# EAGLE design Blinky_Jaras (EAGLE 8.2.0)
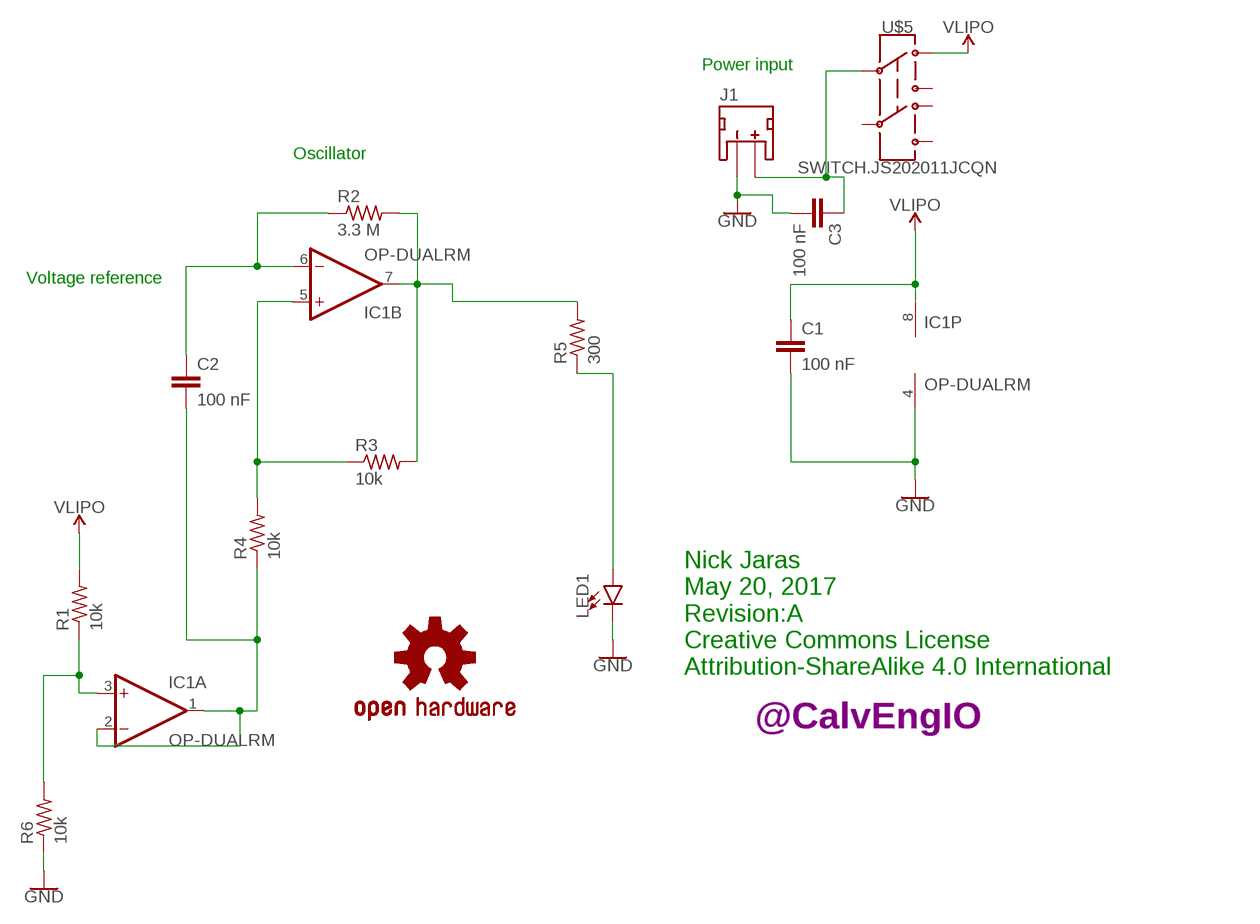
[diagram p0: schematic, sheet 1]

## Parts
C1  100 nF  CAPACITOR0402  [C0402]
C2  100 nF  CAPACITOR0402  [C0402]
C3  100 nF  CAPACITOR0402  [C0402]
IC1  OP-DUALRM  [MSOP08]
J1  JST_2MM_MALE  [JST-2-SMD]
LED1  LED0603  [LED-0603]
LOGO1  OSHW-LOGOS  [OSHW-LOGO-S]
R1  10k  RESISTOR0402  [R0402]
R2  3.3 M  RESISTOR0402  [R0402]
R3  10k  RESISTOR0402  [R0402]
R4  10k  RESISTOR0402  [R0402]
R5  300  RESISTOR0402  [R0402]
R6  10k  RESISTOR0402  [R0402]
U$4  CALVENGIO_HANDLEHANDLE.05  [CALVENGIO_HANDLE.05]
U$5  SWITCH.JS202011JCQN  [SWITCH.00]

## Nets
GND: C1.2 C3.2 IC1.4(P:V-) J1.1(-) LED1.C R6.1
N$1: C3.1 J1.2(+) U$5.2
N$2: IC1.5(B:+IN) R3.1 R4.2
N$3: IC1.7(B:OUT) R2.2 R3.2 R5.2
N$4: C2.1 IC1.6(B:-IN) R2.1
N$7: LED1.A R5.1
N$8: C2.2 IC1.1(A:OUT) IC1.2(A:-IN) R4.1
N$10: IC1.3(A:+IN) R1.1 R6.2
VLIPO: C1.1 IC1.8(P:V+) R1.2 U$5.1
Unconnected: J1.NC1(PAD1) J1.NC2(PAD2) U$5.3 U$5.5 U$5.6 U$5.7

## Notes on the sheet
- Power input
- Oscillator
- Voltage reference
- Nick Jaras
  May 20, 2017
  Revision:A
  Creative Commons License
  Attribution-ShareAlike 4.0 International

## Library data of the parts
C1-C3 = CalvEngIO-Passives:CAPACITOR
IC1 = CalvEngIO-AnalogIC:OP-DUAL: Precision Micropower, Low Noise CMOS, Rail-to-Rail Input/Output Operational Amplifiers Source: http://www.analog.com/static/imported-files/data_sheets/AD8603_8607_8609.pdf; MF: ALTERA CORPORATION; MPN: AD8607ARMZ-REEL; OC_FARNELL: 1464990; OC_NEWARK: 59K6925
J1 = CalvEngIO-Connectors:JST_2MM_MALE: JST 2MM MALE RA CONNECTOR Two pin, compact surface mount connector. Commonly used as a battery input connection point. We really like the solid locking feeling and high current rating on these small connectors. We use these all the time as battery connectors. Mates to single-cell LiPo batteries. Here is the connector we sell at SparkFun: JST Right Angle Connector - White <https://www.sparkfun.com/products/8612> (PRT-08612) Datasheet <http://www.sparkfun.com/datasheets/Prototyping/Connectors/JST-Horizontal.pdf> It was used on these SparkFun products: SparkFun MOSFET Power Controller <https://www.sparkfun.com/products/11214> (PRT-11214) SparkFun Battery Babysitter - LiPo Battery Manager <https://www.sparkfun.com/products/13777> (PRT-13777) And many, many others that required a lipo battery connection.; PROD_ID: CONN-11443; SF_ID: PRT-08612
LED1 = CalvEngIO-LED:LED: LED (Generic) Standard schematic elements and footprints for 5mm, 3mm, 1206, and 0603 sized LEDs. Generic LEDs with no color specified.
LOGO1 = CalvEngIO-Logos:OSHW-LOGO: Open-Source Hardware (OSHW) Logo This logo indicates the piece of hardware it is found on incorporates a OSHW license and/or adheres to the definition of open source hardware found here: http://freedomdefined.org/OSHW
R1-R6 = CalvEngIO-Passives:RESISTOR
U$4 = CalvEngIO-Logos:CALVENGIO_HANDLE
U$5 = CalvEngIO-Switches:SWITCH.JS202011JCQN

## Board
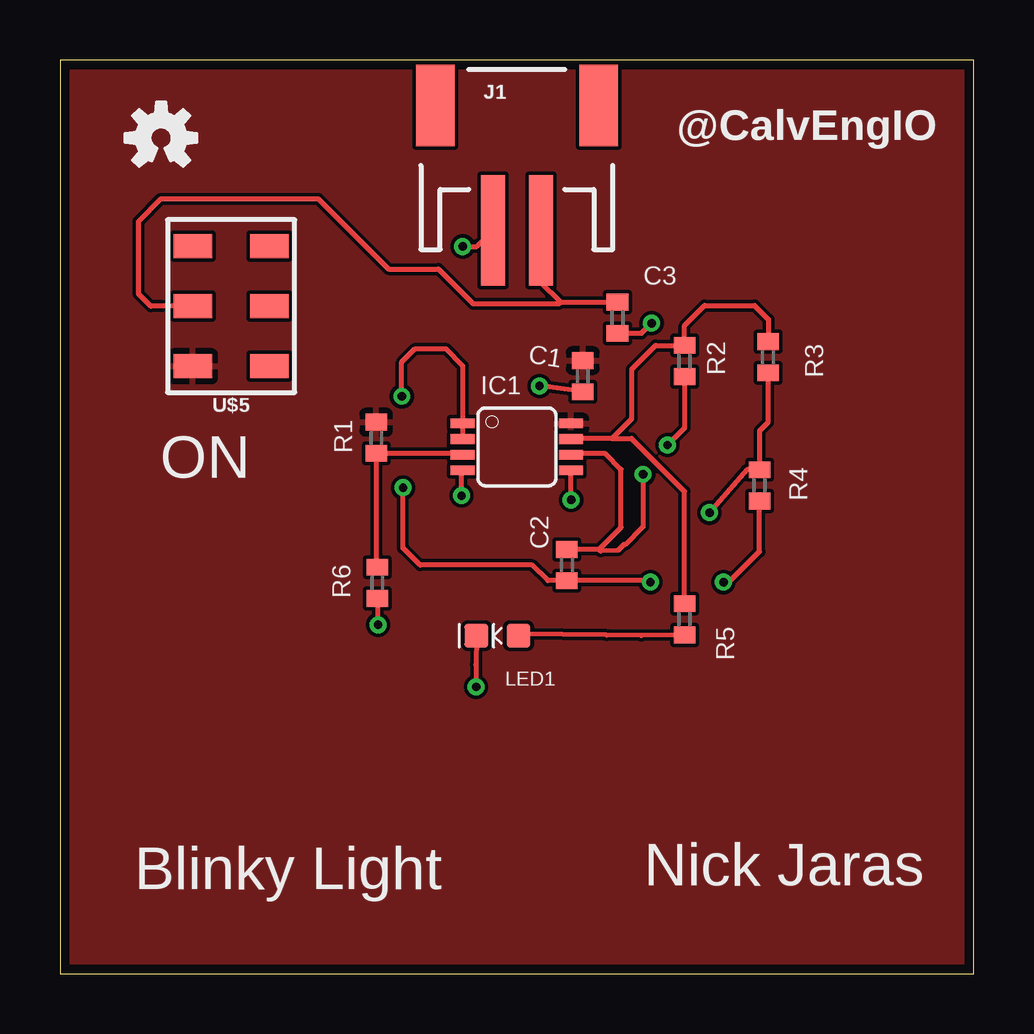
[diagram p1: board, top side]
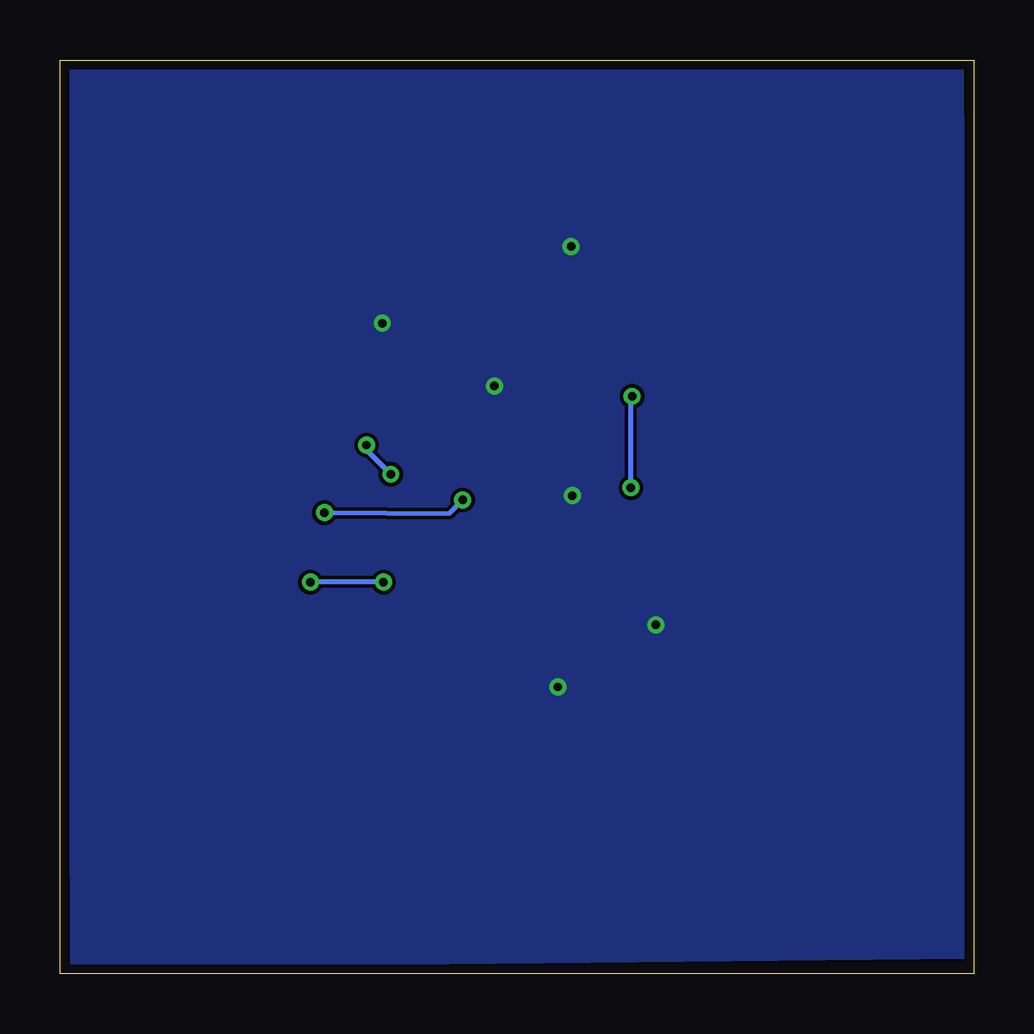
[diagram p2: board, bottom side, seen from below]

Size 38.1 x 38.1 mm. Coordinates in mm from the lower left corner, seen from the top.
Outline: 0,0 38.1,0 38.1,38.1 0,38.1 0,0
Copper layers (1*16): Top 0.0356mm / dielectric 1.5011mm / Bottom 0.0356mm
Design rules "LaenPCBOrder": minimum track width 6mil, minimum drill 13mil, track to track 6mil, track to pad 6mil, pad to pad 6mil, via to via 6mil, smd to smd 6mil, copper to edge 15mil, drill to drill 6mil, minimum pad ring 7mil, minimum via ring 7mil, stop-mask expansion 3mil, vias tented up to drill 0mil, thermal gap 10mil

### Footprints (pad centres in the part's own frame; a part is rotated, then mirrored left to right if it is on the bottom)
C0402 = smd 0.7 x 0.9: 1 -0.65,0; 2 0.65,0
MSOP08 = smd 0.4 x 1: 1 -0.976,-2.263; 2 -0.326,-2.263; 3 0.324,-2.263; 4 0.974,-2.263; 5 0.974,2.262; 6 0.324,2.262; 7 -0.326,2.262; 8 -0.976,2.262
JST-2-SMD = smd 1 x 4.6: 1 -1,-3.7; 2 1,-3.7 | smd 1.6 x 3.4: NC1 -3.4,1.5; NC2 3.4,1.5
LED-0603 = smd 1 x 1: A -0.877,0; C 0.877,0
R0402 = smd 0.7 x 0.9: 1 -0.65,0; 2 0.65,0
SWITCH.00 = smd 1 x 1.6: 1 -2.5,1.6; 2 0,1.6; 3 2.5,1.6; 5 -2.5,-1.6; 6 0,-1.6; 7 2.5,-1.6

### Placement (x,y rotation side)
C1  21.79,24.92 270 top
C2  21.13,17.04 270 top
C3  23.24,27.36 270 top
IC1  19.05,21.97 270 top
J1  19.05,34.7 0 top
LED1  18.24,14.1 180 top
LOGO1  4.22,34.85 0 top
R1  13.18,22.35 90 top
R2  26.04,25.55 90 top
R3  29.51,25.7 90 top
R4  29.16,20.37 90 top
R5  26.04,14.78 90 top
R6  13.23,16.31 90 top
U$4  30.78,34.75 0 top
U$5  7.14,27.84 90 top

### Tracks (layer width: path | path; a pad name or v marks a point on that pad's centre or on a via)
GND  (via drill 0.35 pad 0.6)
  Top 0.203: v13.26,14.55 13.26,15.63 R6.1 | LED1.C 17.34,12.89 v17.35,11.96 | v16.74,19.94 16.74,20.95 IC1.4 | C1.2 20.41,24.47 v19.99,24.51 | C3.2 24.24,26.71 v24.66,27.13 | v16.79,30.33 17.38,30.33 J1.1
  pour Bottom: 0.48,37.82 37.72,37.82 37.62,0.3 0.3,0.69
N$1
  Top 0.203: 20.86,28.01 C3.1 | 20.86,28.01 20.04,28.83 20.04,30.99 J1.2 | U$5.2 3.79,27.84 3.28,28.35 3.28,31.37 4.22,32.31 10.77,32.31 13.69,29.39 15.77,29.39 17.22,27.94 20.8,27.94 20.86,28.01
N$2  (via drill 0.35 pad 0.6)
  Top 0.203: R3.1 29.52,22.99 29.16,22.63 R4.2 28.64,21.02 v27.08,19.23 | v21.31,19.76 IC1.5
  Bottom 0.203: v27.08,19.23 21.87,19.2 v21.31,19.76
N$3
  Top 0.203: R5.2 26.04,20.12 23.82,22.33 23.01,22.33 | 23.01,22.33 21.34,22.33 IC1.7 | R3.2 29.54,26.38 29.54,27.28 28.96,27.86 26.87,27.86 26.04,27.03 R2.2 24.83,26.2 23.82,25.2 23.82,23.14 23.01,22.33
N$4  (via drill 0.35 pad 0.6)
  Top 0.203: 22.47,17.69 C2.1 | 22.47,17.69 23.39,18.62 23.39,21.03 22.73,21.69 21.36,21.69 IC1.6 | R2.1 26.04,22.76 v25.32,22.05 | v24.31,20.83 24.31,18.64 23.55,17.88 23.52,17.91 23.27,17.65 22.53,17.63 22.47,17.69
  Bottom 0.203: v25.32,22.05 25.32,21.84 v24.31,20.83
N$7
  Top 0.203: R5.1 24.22,14.11 22.78,14.12 19.11,14.17 LED1.A
N$8  (via drill 0.35 pad 0.6)
  Top 0.203: v24.61,16.33 24.55,16.39 C2.2 20.34,16.39 19.68,17.04 15.01,17.04 14.3,17.75 v14.3,20.27 | v27.66,16.33 27.89,16.33 29.16,17.6 R4.1 | v14.25,24.08 14.25,25.5 14.81,26.06 16.08,26.06 16.79,25.35 IC1.1 16.79,22.94 16.79,22.41 16.79,22.4 IC1.2
  Bottom 0.203: v24.61,16.33 v27.66,16.33 | v14.3,20.27 14.3,24.03 v14.25,24.08
N$10
  Top 0.203: IC1.3 16.73,21.7 R1.1 13.18,17.01 R6.2
VLIPO
  pour Top: 0.28,37.85 38.02,37.82 38.02,0.1 0.1,0.1

### Text on the board
tNames: ON | Blinky Light | Nick Jaras